# Altium schematic sheet Sensors.SchDoc
size A; DocumentNumber: 3; SheetNumber: 3; SheetTotal: 5
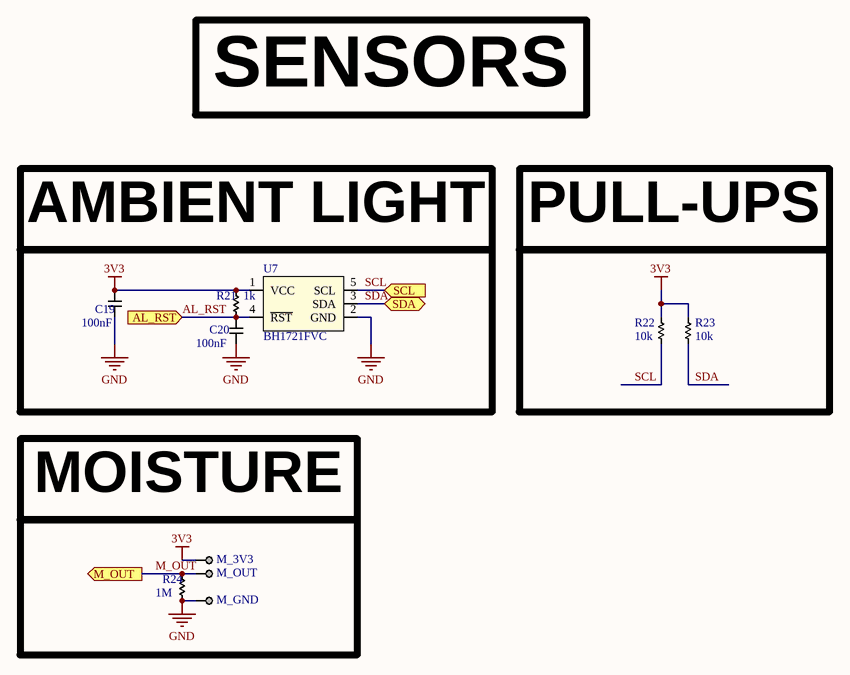
[diagram p0: Sensors.SchDoc]

## Parts
C19  100nF  [CAP_0402_HIGH]
C20  100nF  [CAP_0402_HIGH]
M_3V3  0.1" Header  [0.1" Header]  (value not drawn)  (no BOM)
M_GND  0.1" Header  [0.1" Header]  (value not drawn)  (no BOM)
M_OUT  0.1" Header  [0.1" Header]  (value not drawn)  (no BOM)
R21  1k  [RES_0402_HIGH]
R22  10k  [RES_0402_HIGH]
R23  10k  [RES_0402_HIGH]
R24  1M  [RES_0402_HIGH]
U7  BH1721FVC  [BH1721FVC]

## Ports
AL_RST (in), M_OUT (out), SCL (in), SDA

## Nets
3V3: C19.2 M_3V3.1 R21.2 R22.2 R23.2 U7.1(VCC)
GND: C19.1 C20.1 M_GND.1 R24.1 U7.2(GND)
AL_RST: C20.2 R21.1 U7.4(~{RST}) ; port AL_RST
M_OUT: M_OUT.1 R24.2 ; port M_OUT
SCL: R22.1 U7.5(SCL) ; port SCL
SDA: R23.1 U7.3(SDA) ; port SDA

## Notes on the sheet
- SENSORS
- AMBIENT LIGHT
- PULL-UPS
- MOISTURE

## Library data of the parts
C19 C20 = Capacitor_0402: 0402 Capacitor
R21-R24 = Resistor_0402: 0402 Resistor
U7 = BH1721FVC: BH1721FVC Optical Sensor Ambient 560nm I²C 5-SMD, Flat Leads